# Altium project OutputBoard.PrjPcb
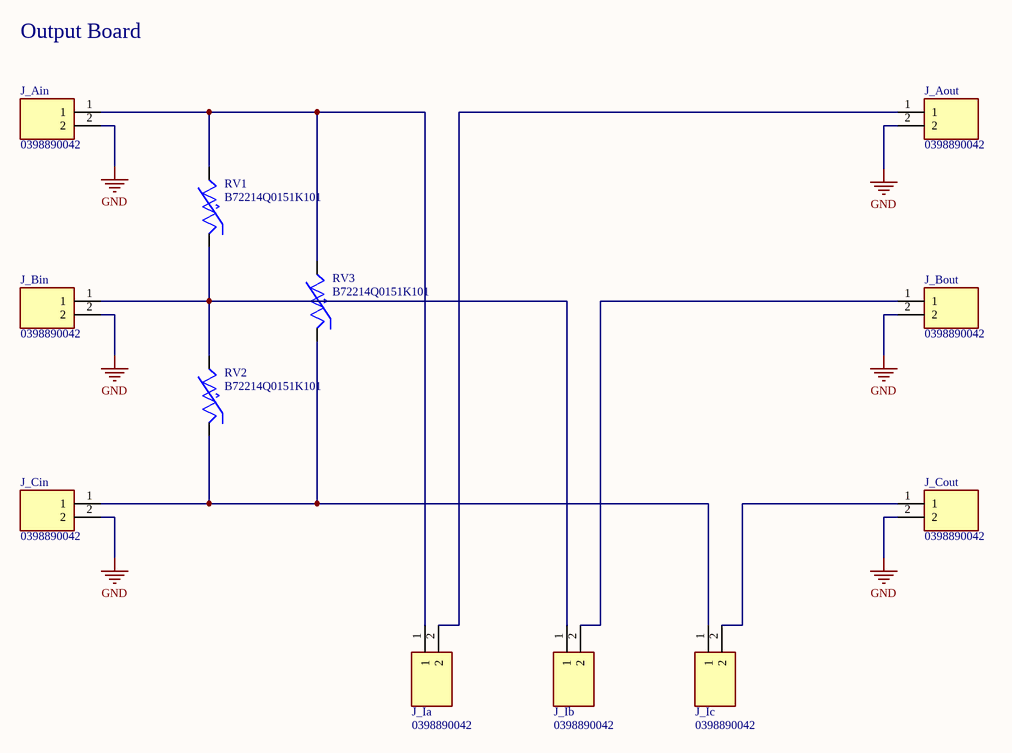
[diagram p0: OutputBoard.SchDoc]
1 sheet, 12 parts. Net scope: global (net labels, ports and power ports of the same name join across sheets).
Board file: OutputBoard.PcbDoc

## Sheet OutputBoard.SchDoc
size A; SheetNumber: 1; SheetTotal: 1

### Parts
J_Ain  0398890042  [0398890042]
J_Aout  0398890042  [0398890042]
J_Bin  0398890042  [0398890042]
J_Bout  0398890042  [0398890042]
J_Cin  0398890042  [0398890042]
J_Cout  0398890042  [0398890042]
J_Ia  0398890042  [0398890042]
J_Ib  0398890042  [0398890042]
J_Ic  0398890042  [0398890042]
RV1  B72214Q0151K101  [VAR_B72214Q0151K101]
RV2  B72214Q0151K101  [VAR_B72214Q0151K101]
RV3  B72214Q0151K101  [VAR_B72214Q0151K101]

### Nets
GND: J_Ain.2 J_Aout.2 J_Bin.2 J_Bout.2 J_Cin.2 J_Cout.2
NetJ_Ain_1: J_Ain.1 J_Ia.1 RV1.2 RV3.2
NetJ_Aout_1: J_Aout.1 J_Ia.2
NetJ_Bin_1: J_Bin.1 J_Ib.1 RV1.1 RV2.2
NetJ_Bout_1: J_Bout.1 J_Ib.2
NetJ_Cin_1: J_Cin.1 J_Ic.1 RV2.1 RV3.1
NetJ_Cout_1: J_Cout.1 J_Ic.2

### Notes on the sheet
- Output Board

### Library data of the parts
J_Ain J_Aout J_Bin J_Bout J_Cin J_Cout J_Ia J_Ib J_Ic = 0398890042: Conn Eurostyle Block 2 POS 5.08mm Solder ST Thru-Hole 17.5A/Contact; Manufacturer_Name: Molex; Geometry.Height: 10.25mm; TTI Part Number: *; TTI Price/Stock: *; Manufacturer_Part_Number: 0398890042; Datasheet Link: https://tools.molex.com/pdm_docs/sd/398890042_sd.pdf
RV1-RV3 = B72214Q0151K101: 240 V 8 kA Varistor 1 Circuit Through Hole Radial; MF: EPCOS; SnapEDA_Link: https://www.snapeda.com/parts/B72214Q0151K101/EPCOS/view-part/?ref=snap; Package: None; Value: *; MP: B72214Q0151K101; Check_prices: https://www.snapeda.com/parts/B72214Q0151K101/EPCOS/view-part/?ref=eda